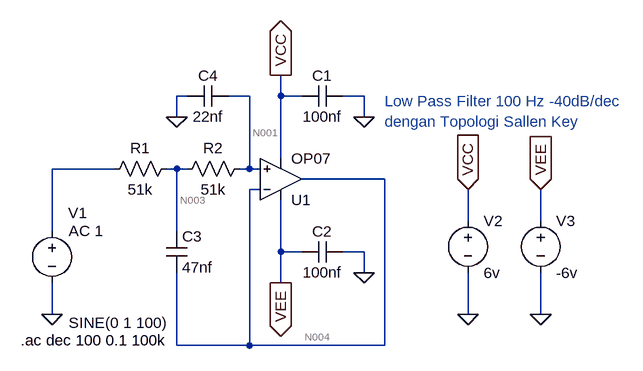
[diagram p0: schematic Low Pass Filter.asc]
Low Pass Filter.asc, the LTspice schematic file:
Version 4
SHEET 1 880 680
WIRE 80 -160 64 -160
WIRE 176 -160 144 -160
WIRE 224 -160 224 -192
WIRE 256 -160 224 -160
WIRE 352 -160 320 -160
WIRE 64 -128 64 -160
WIRE 352 -128 352 -160
WIRE 224 -64 224 -160
WIRE -32 -48 -128 -48
WIRE 64 -48 48 -48
WIRE 80 -48 64 -48
WIRE 176 -48 176 -160
WIRE 176 -48 160 -48
WIRE 192 -48 176 -48
WIRE 384 -32 256 -32
WIRE 192 -16 176 -16
WIRE 512 32 512 -16
WIRE 624 32 624 -16
WIRE -128 48 -128 -48
WIRE 64 48 64 -48
WIRE 224 80 224 0
WIRE 256 80 224 80
WIRE 352 80 320 80
WIRE 352 112 352 80
WIRE 224 128 224 80
WIRE -128 176 -128 128
WIRE 512 176 512 112
WIRE 624 176 624 112
WIRE 64 224 64 112
WIRE 176 224 176 -16
WIRE 176 224 64 224
WIRE 384 224 384 -32
WIRE 384 224 176 224
FLAG 352 -128 0
FLAG 352 112 0
FLAG 224 -192 VCC
IOPIN 224 -192 Out
FLAG 224 128 VEE
IOPIN 224 128 Out
FLAG 64 -128 0
FLAG -128 176 0
FLAG 512 -16 VCC
IOPIN 512 -16 In
FLAG 512 176 0
FLAG 624 -16 VEE
IOPIN 624 -16 In
FLAG 624 176 0
SYMBOL OpAmps\\OP07 224 32 M180
SYMATTR InstName U1
SYMBOL cap 320 -176 R90
WINDOW 0 0 32 VBottom 2
WINDOW 3 32 32 VTop 2
SYMATTR InstName C1
SYMATTR Value 100nf
SYMBOL cap 320 64 R90
WINDOW 0 0 32 VBottom 2
WINDOW 3 32 32 VTop 2
SYMATTR InstName C2
SYMATTR Value 100nf
SYMBOL res 64 -64 R90
WINDOW 0 0 56 VBottom 2
WINDOW 3 32 56 VTop 2
SYMATTR InstName R1
SYMATTR Value 51k
SYMBOL res 176 -64 R90
WINDOW 0 0 56 VBottom 2
WINDOW 3 32 56 VTop 2
SYMATTR InstName R2
SYMATTR Value 51k
SYMBOL cap 48 48 R0
SYMATTR InstName C3
SYMATTR Value 47nf
SYMBOL cap 144 -176 R90
WINDOW 0 0 32 VBottom 2
WINDOW 3 32 32 VTop 2
SYMATTR InstName C4
SYMATTR Value 22nf
SYMBOL voltage -128 32 R0
WINDOW 0 25 -12 Left 2
WINDOW 3 26 157 Left 2
WINDOW 123 26 16 Left 2
WINDOW 39 0 0 Left 0
SYMATTR InstName V1
SYMATTR Value SINE(0 1 100)
SYMATTR Value2 AC 1
SYMBOL voltage 512 16 R0
WINDOW 123 0 0 Left 0
WINDOW 39 0 0 Left 0
SYMATTR InstName V2
SYMATTR Value 6v
SYMBOL voltage 624 16 R0
WINDOW 123 0 0 Left 0
WINDOW 39 0 0 Left 0
SYMATTR InstName V3
SYMATTR Value -6v
TEXT 384 -152 Left 2 ;Low Pass Filter 100 Hz -40dB/dec\ndengan Topologi Sallen Key
TEXT -176 216 Left 2 !.ac dec 100 0.1 100k

The netlist it stands for:
* Low Pass Filter.asc
XU1 N001 N004 VEE VCC N004 LT1001  ; OP07, pins In+ In- V+ V- OUT
C1 0 VCC 100nf
C2 0 VEE 100nf
R1 N003 N002 51k
R2 N001 N003 51k
C3 N003 N004 47nf
C4 N001 0 22nf
V1 N002 0 SINE(0 1 100) AC 1
V2 VCC 0 6v
V3 VEE 0 -6v
* Low Pass Filter 100 Hz -40dB/dec
* dengan Topologi Sallen Key
.ac dec 100 0.1 100k
.lib LTC.lib
.backanno
.end

* Results of the author's LTspice run, read from the files saved beside the schematic
* Operating Point, zero values left out:
*   V(vee) = -6 V
*   V(vcc) = 6 V
*   I(V3) = 4.572 TA
*   I(V2) = -4.572 TA
*   Ix(u1:3) = -4.572 TA
*   Ix(u1:4) = 4.572 TA
*   Ix(u1:5) = -976.6 µA
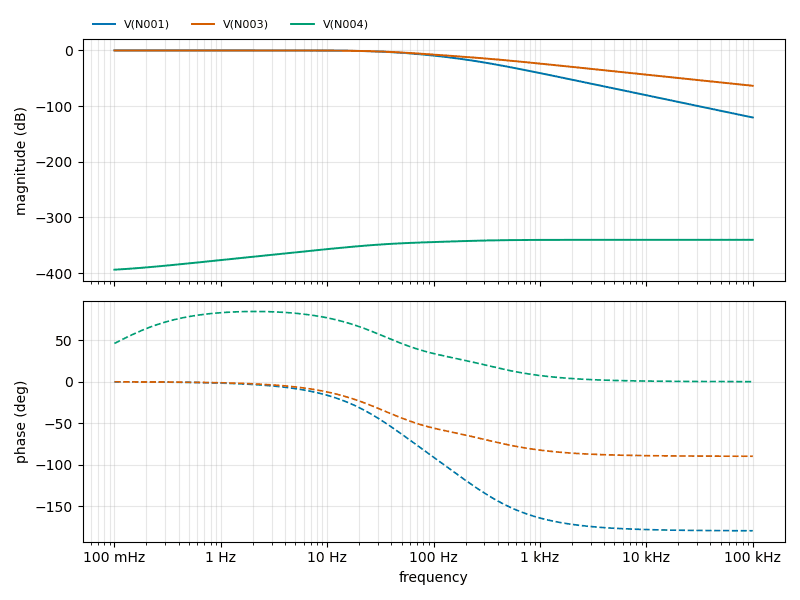
[diagram p1: AC Analysis of Low Pass Filter.asc, plotted from the saved traces]
* AC Analysis, 1 run:
*   V(N001): -0.01 dB at 100 mHz, -120.52 dB at 100 kHz, peak -0.01 dB at 100 mHz, 3 dB below the peak at 39.11 Hz
*   V(N003): -0.01 dB at 100 mHz, -63.56 dB at 100 kHz, peak -0.01 dB at 100 mHz, 3 dB below the peak at 42.35 Hz
*   V(N004): -393.81 dB at 100 mHz, -340.17 dB at 100 kHz, peak -340.17 dB at 100 kHz, 3 dB below the peak at 143.8 Hz